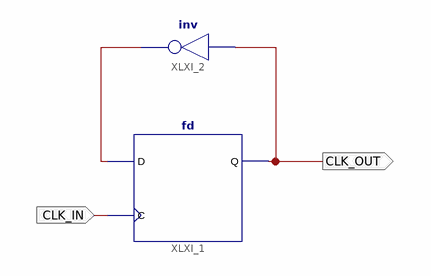
[diagram p0: schematic sheet 1]
// Xilinx ISE schematic CLK_DIV_2.sch (spartan6) as structural Verilog: 2 symbols, 2 ports
module CLK_DIV_2 (
  input  CLK_IN,
  output CLK_OUT
);

  wire XLXN_2;

  fd XLXI_1 (.C(CLK_IN), .D(XLXN_2), .Q(CLK_OUT));
  not XLXI_2 (XLXN_2, CLK_OUT);
endmodule
